# EAGLE design iNDUCTIVE LOOP (EAGLE 7.6.0)
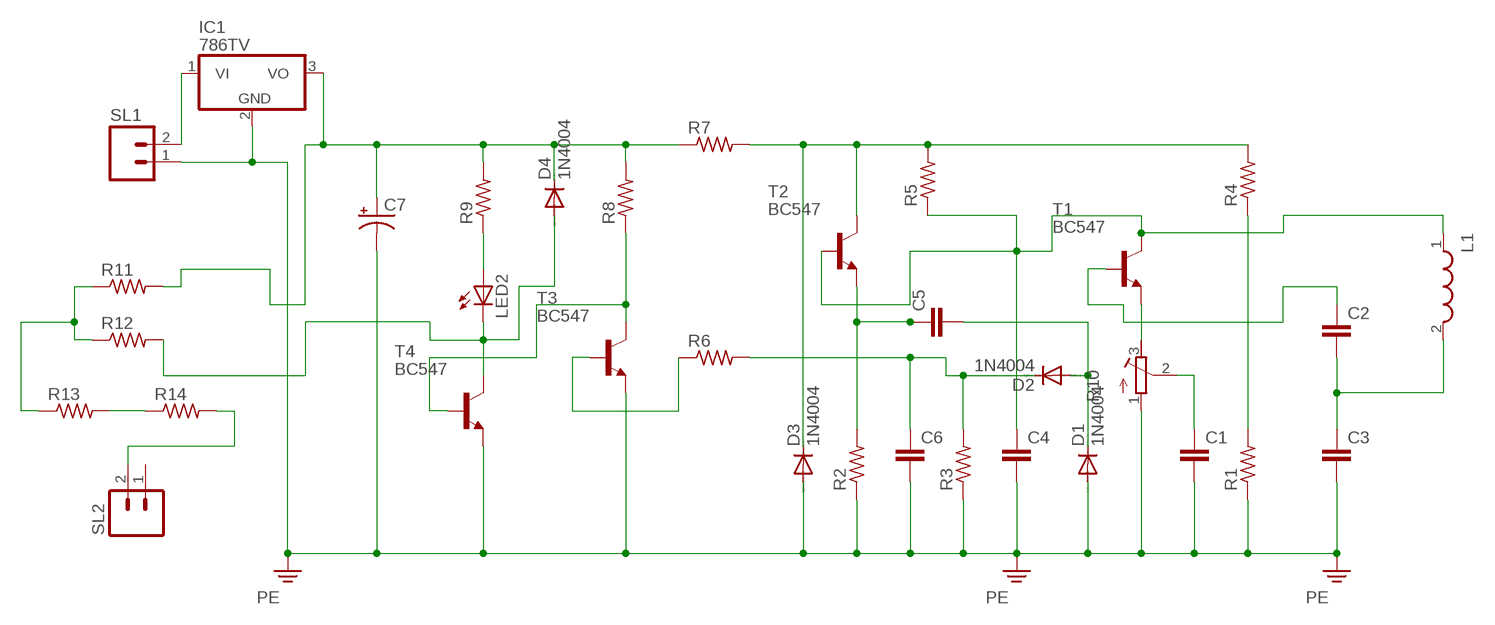
[diagram p0: schematic, sheet 1]

## Parts
C1  C5/2.5  [C5B2.5]
C2  C5/2.5  [C5B2.5]
C3  C5/2.5  [C5B2.5]
C4  C5/2.5  [C5B2.5]
C5  C5/2.5  [C5B2.5]
C6  C5/2.5  [C5B2.5]
C7  CPOL-USE2.5-6  [E2,5-6]
D1  1N4004  [DO41-10]
D2  1N4004  [DO41-10]
D3  1N4004  [DO41-10]
D4  1N4004  [DO41-10]
IC1  786TV  [TO220V]
L1  WE-WPCC_1W_3737  [WE-WPCC_3737]
LED2  LEDLD260  [LD260]
R1  R-US_0204/7  [0204/7]
R2  R-US_0204/7  [0204/7]
R3  R-US_0204/7  [0204/7]
R4  R-US_0204/7  [0204/7]
R5  R-US_0204/7  [0204/7]
R6  R-US_0204/7  [0204/7]
R7  R-US_0204/7  [0204/7]
R8  R-US_0204/7  [0204/7]
R9  R-US_0204/7  [0204/7]
R10  R-TRIMM64P  [RTRIM64P]
R11  R-US_0204/7  [0204/7]
R12  R-US_0204/7  [0204/7]
R13  R-US_0204/7  [0204/7]
R14  R-US_0204/7  [0204/7]
SL1  MA02  [02PA]
SL2  MA02  [02PA]
T1  BC547  [TO92]
T2  BC547  [TO92]
T3  BC547  [TO92]
T4  BC547  [TO92]

## Nets
N$1: R11.1 R12.1 R13.1
N$2: D3.C R4.2 R5.2 R7.2 T2.3(C)
N$3: R6.1 T3.2(B)
N$4: C6.1 D2.C R3.2 R6.2
N$5: R8.1 T3.3(C) T4.2(B)
N$6: LED2.A R9.1
N$7: IC1.1(VI) SL1.2
N$8: D4.A LED2.K(C) R12.2 T4.3(C)
N$10: C5.1 R2.2 T2.1(E)
N$11: C4.1 L1.1 R5.1 T1.3(C) T2.2(B)
N$12: C5.2 D1.C D2.A
N$14: R10.3(E) T1.1(E)
N$15: C1.1 R10.2(S)
N$16: R1.2 R4.1
N$17: C2.2 C3.1 L1.2
N$18: C2.1 T1.2(B)
N$19: C7.+ D4.C IC1.3(VO) R7.1 R8.2 R9.2 R11.2
N$20: R13.2 R14.1
N$21: R14.2 SL2.2
PE: C1.2 C3.2 C4.2 C6.2 C7.- D1.A D3.A IC1.2(GND) R1.1 R2.1 R3.1 R10.1(A) SL1.1 T3.1(E) T4.1(E)
Unconnected: SL2.1

## Library data of the parts
C1-C6 = capacitor-wima:C: CAPACITOR naming: grid - package width
C7 = rcl:CPOL-US: POLARIZED CAPACITOR, American symbol
D1-D4 = diode:1N4004: DIODE general purpose rectifier, 1 A
IC1 = linear:78*: Positive VOLTAGE REGULATOR Source: http://cache.national.com/ds/LM/LM78L05.pdf http://www.fairchildsemi.com/ds/LM/LM7805.pdf
L1 = Wurth_Elektronik_Passive_rev15c:WE-WPCC_1W: Wireless Power Charging Coil -Qi standard compliant -Thinnest on the market -Easiness of assembly -Evaluated and approved by very major semiconductor manufacturer -Litz wire-highest Q-value on the market -Applicable for up to 5W -High permeability shielding -Cancels charging flux to be not coupled into sensitive components or batteries -High reliable construction -- Portable devices used in a clean area .where connectors pose a risk of polluting e.g. medical facilities,(industrial )clean rooms,mining industry --Devices with a large number of mating cycles to avoid connector damage:eg.Smart watches,fittness tracker... --Consumer products:eg. Digital cameras,baby phone,walkie talky remote control,smartphone sleeves,watertight products --Explosion sensitive area where the use of a physical connection is hazardous --Smart sensors <http://katalog.we-online.de/media/images/eisos/UtWPCC_Receiver_pf2.jpg> Details see: http://katalog.we-online.de/en/pbs/WE-WPCC_Receiver Created by Dan Xu 2014-05-21 2014 (C) Würth Elektronik
LED2 = led:LED: LED OSRAM: - CHIPLED LG R971, LG N971, LY N971, LG Q971, LY Q971, LO R971, LY R971 LH N974, LH R974 LS Q976, LO Q976, LY Q976 LO Q996 - Hyper CHIPLED LW Q18S LB Q993, LB Q99A, LB R99A - SideLED LS A670, LO A670, LY A670, LG A670, LP A670 LB A673, LV A673, LT A673, LW A673 LH A674 LY A675 LS A676, LA A676, LO A676, LY A676, LW A676 LS A679, LY A679, LG A679 - Hyper Micro SIDELED® LS Y876, LA Y876, LO Y876, LY Y876 LT Y87S - SmartLED LW L88C, LW L88S LB L89C, LB L89S, LG L890 LS L89K, LO L89K, LY L89K LS L896, LA L896, LO L896, LY L896 - TOPLED LS T670, LO T670, LY T670, LG T670, LP T670 LSG T670, LSP T670, LSY T670, LOP T670, LYG T670 LG T671, LOG T671, LSG T671 LB T673, LV T673, LT T673, LW T673 LH T674 LS T676, LA T676, LO T676, LY T676, LB T676, LH T676, LSB T676, LW T676 LB T67C, LV T67C, LT T67C, LS T67K, LO T67K, LY T67K, LW E67C LS E67B, LA E67B, LO E67B, LY E67B, LB E67C, LV E67C, LT E67C LW T67C LS T679, LY T679, LG T679 LS T770, LO T770, LY T770, LG T770, LP T770 LB T773, LV T773, LT T773, LW T773 LH T774 LS E675, LA E675, LY E675, LS T675 LS T776, LA T776, LO T776, LY T776, LB T776 LHGB T686 LT T68C, LB T68C - Hyper Mini TOPLED® LB M676 - Mini TOPLED Santana® LG M470 LS M47K, LO M47K, LY M47K Source: http://www.osram.convergy.de LUXEON: - LUMILED® LXK2-PW12-R00, LXK2-PW12-S00, LXK2-PW14-U00, LXK2-PW14-V00 LXK2-PM12-R00, LXK2-PM12-S00, LXK2-PM14-U00 LXK2-PE12-Q00, LXK2-PE12-R00, LXK2-PE12-S00, LXK2-PE14-T00, LXK2-PE14-U00 LXK2-PB12-K00, LXK2-PB12-L00, LXK2-PB12-M00, LXK2-PB14-N00, LXK2-PB14-P00, LXK2-PB14-Q00 LXK2-PR12-L00, LXK2-PR12-M00, LXK2-PR14-Q00, LXK2-PR14-R00 LXK2-PD12-Q00, LXK2-PD12-R00, LXK2-PD12-S00 LXK2-PH12-R00, LXK2-PH12-S00 LXK2-PL12-P00, LXK2-PL12-Q00, LXK2-PL12-R00 Source: www.luxeon.com KINGBRIGHT: KA-3528ASYC Source: www.kingbright.com
R1-R9 R11-R14 = rcl:R-US_: RESISTOR, American symbol
R10 = rcl:R-TRIMM: Trimm resistor
SL1 SL2 = con-amp-quick:MA02: AMP QUICK CONNECTOR; OC_FARNELL: unknown; OC_NEWARK: unknown
T1-T4 = transistor:BC547: NPN TRANSISTOR

## Board
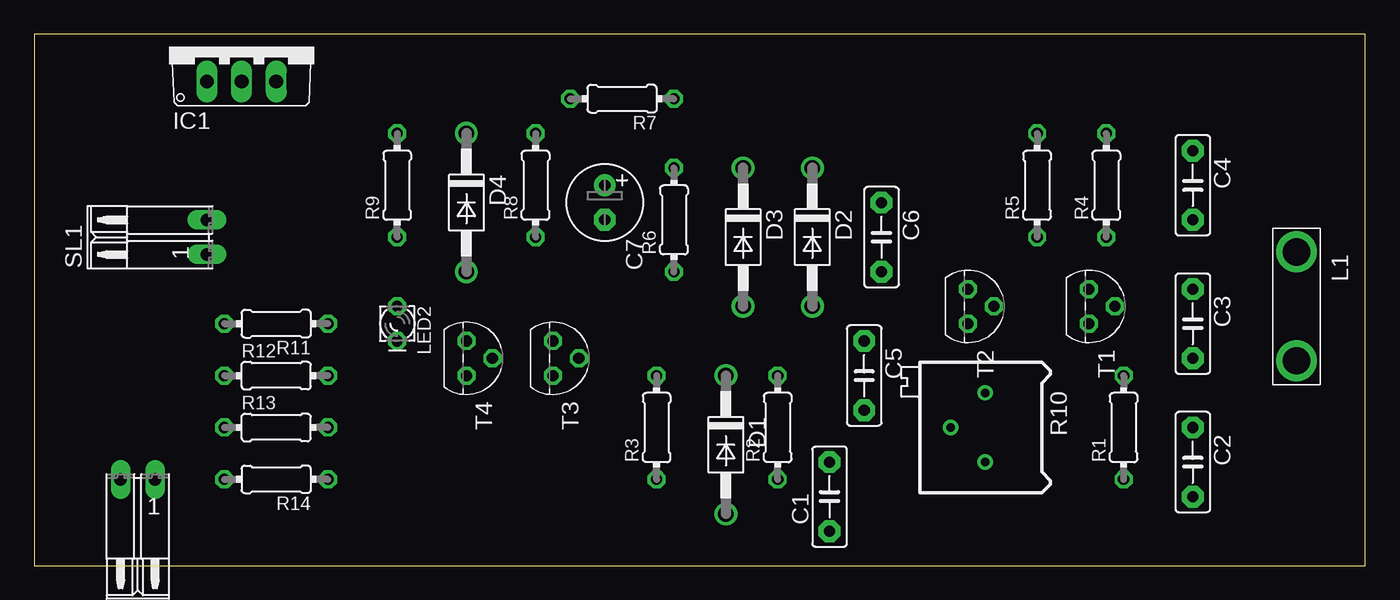
[diagram p1: board, top side]
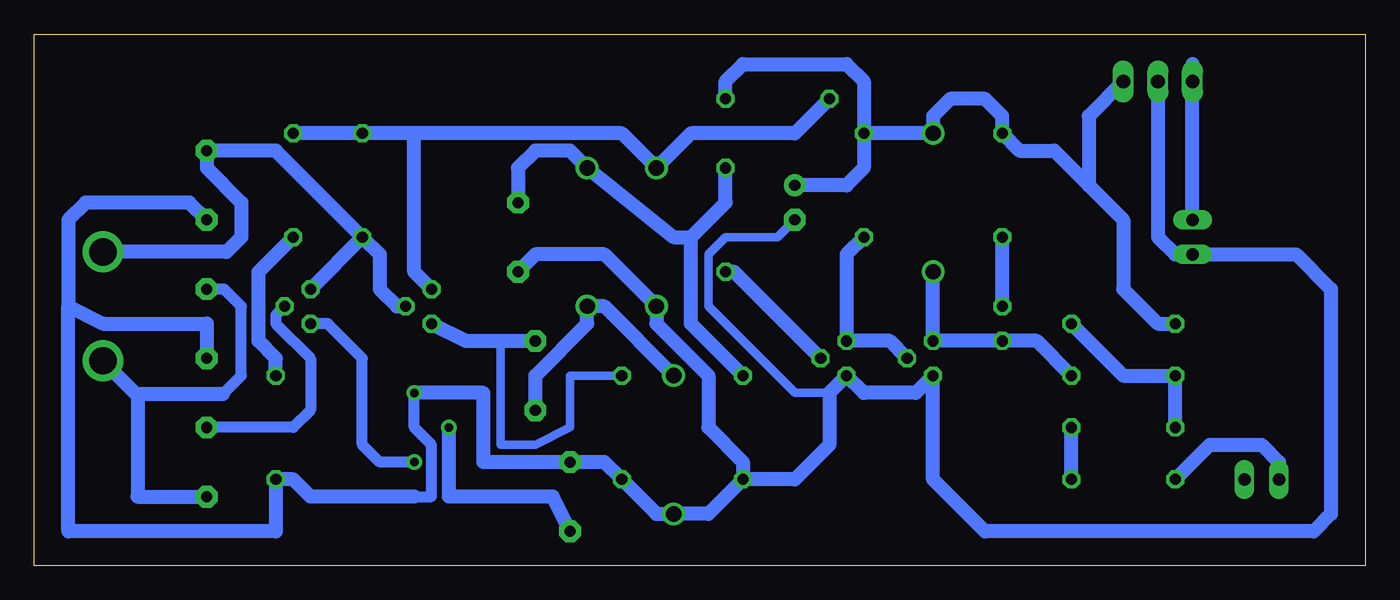
[diagram p2: board, bottom side, seen from below]

Size 97.77 x 39.04 mm. Coordinates in mm from the lower left corner, seen from the top.
Outline: 0,0 97.77,0 97.77,39.04 0,39.04 0,0
Copper layers (1*16): Top 0.035mm / dielectric 1.5mm / Bottom 0.035mm
Design rules "default": minimum track width 10mil, minimum drill 24mil, track to track 8mil, track to pad 8mil, pad to pad 8mil, via to via 8mil, smd to smd 8mil, copper to edge 40mil, drill to drill 8mil, minimum pad ring 10mil, minimum via ring 8mil, stop-mask expansion 4mil, vias tented up to drill 0mil, thermal gap 10mil

### Footprints (pad centres in the part's own frame; a part is rotated, then mirrored left to right if it is on the bottom)
C5B2.5 = drill 0.813 pad 1.6 octagon: 1 -2.54,0; 2 2.54,0
E2,5-6 = drill 0.813 pad 1.6: + -1.27,0 | drill 0.813 pad 1.6 octagon: - 1.27,0
DO41-10 = drill 1.118: A 5.08,0; C -5.08,0
TO220V = drill 1.016 long: 1 -2.54,-2.54; 2 0,-2.54; 3 2.54,-2.54
WE-WPCC_3737 = drill 2: 1 -4,0; 2 4,0
LD260 = drill 0.813 octagon: A -1.27,0; K 1.27,0
0204/7 = drill 0.813 octagon: 1 -3.81,0; 2 3.81,0
RTRIM64P = drill 0.61: 1 0,-2.54; 2 2.54,0; 3 0,2.54
02PA = drill 0.914 long: 1 -1.27,0; 2 1.27,0
TO92 = drill 0.813 octagon: 1 1.27,0; 2 0,1.905; 3 -1.27,0

### Placement (x,y rotation side)
C1  58.42,5.08 90 top
C2  85.09,7.62 270 top
C3  85.09,17.78 270 top
C4  85.09,27.94 270 top
C5  60.96,13.97 270 top
C6  62.23,24.13 270 top
C7  41.91,26.67 270 top
D1  50.8,8.89 270 top
D2  57.15,24.13 270 top
D3  52.07,24.13 270 top
D4  31.75,26.67 270 top
IC1  15.24,38.1 0 top
L1  92.71,19.05 270 top
LED2  26.67,17.78 270 top
R1  80.01,10.16 90 top
R2  54.61,10.16 90 top
R3  45.72,10.16 90 top
R4  78.74,27.94 90 top
R5  73.66,27.94 90 top
R6  46.99,25.4 90 top
R7  43.18,34.29 180 top
R8  36.83,27.94 90 top
R9  26.67,27.94 90 top
R10  69.85,10.16 180 top
R11  17.78,17.78 180 top
R12  17.78,13.97 0 top
R13  17.78,10.16 0 top
R14  17.78,6.35 180 top
SL1  12.7,24.13 90 top
SL2  7.62,6.35 180 top
T1  77.47,19.05 270 top
T2  68.58,19.05 270 top
T3  38.1,15.24 270 top
T4  31.75,15.24 270 top

### Tracks (layer width: path | path; a pad name or v marks a point on that pad's centre or on a via)
N$1
  Bottom 1.016: R11.1 17.78,13.97 R12.1 R13.1
N$2
  Bottom 1.016: R7.2 41.91,31.75 49.53,31.75 D3.C 54.61,31.75 69.85,31.75 | 69.85,31.75 R5.2 R4.2 | T2.3 69.85,21.59 69.85,31.75
N$3
  Bottom 1.016: T3.2 46.36,21.59 R6.1
N$4
  Bottom 1.016: C6.1 62.23,29.21 60.96,30.48 58.42,30.48 D2.C 50.8,24.13 49.53,24.13 | R3.2 49.53,17.78 49.53,24.13 | 49.53,24.13 46.99,26.67 R6.2
N$5
  Bottom 1.016: T4.2 34.92,16.51 T3.3 38.1,22.86 R8.1
N$6
  Bottom 1.016: LED2.A R9.1
N$7
  Bottom 1.016: SL1.2 IC1.1 12.7,36.83
N$8
  Bottom 1.016: D4.A T4.3 LED2.K 24.13,16.51 R12.2
N$10
  Bottom 0.61: R2.2 58.42,13.97 58.42,10.16 60.96,8.89 63.5,8.89 63.5,16.51
  Bottom 1.016: T2.1 66.04,16.51 63.5,16.51 C5.1
N$11
  Bottom 1.016: R5.1 80.01,30.48 C4.1 85.09,29.21 82.55,26.67 82.55,24.13 83.63,23.05 L1.1 | R5.1 72.39,22.86 72.39,20.32 71.12,19.05 T2.2 | R5.1 T1.3
N$12
  Bottom 1.016: C5.2 60.96,13.97 57.15,17.78 D2.A 55.88,19.05 D1.C
N$14
  Bottom 0.813: R10.3 72.39,7.62 73.66,8.89 73.66,15.24 76.2,17.78 T1.1
N$15
  Bottom 1.016: R10.2 67.31,5.08 59.69,5.08 C1.1
N$16
  Bottom 1.016: R1.2 80.01,15.24 81.28,16.51 81.28,21.59 R4.1
N$17
  Bottom 0.813: 83.92,12.6 82.55,13.97 82.55,19.05 83.82,20.32 C3.1
  Bottom 1.016: L1.2 90.27,12.6 | 90.27,12.6 90.17,12.51 90.17,5.08 C2.2 | 83.92,12.6 90.27,12.6
N$18
  Bottom 0.813: T1.2 80.01,18.41 80.01,17.78 77.47,15.24 77.47,11.43 78.74,10.16 C2.1
N$19
  Bottom 1.016: R8.2 D4.C 31.75,33.02 30.48,34.29 27.94,34.29 26.67,33.02 R9.2 25.4,30.48 22.86,30.48 20.32,27.94 | R8.2 36.83,29.21 38.1,27.94 C7.+ | R7.1 46.99,35.56 45.72,36.83 38.1,36.83 36.83,35.56 R8.2 | IC1.3 20.32,33.02 20.32,27.94 | 20.32,27.94 17.78,25.4 17.78,20.32 15.24,17.78 R11.2
N$20
  Bottom 1.016: R14.1 R13.2
N$21
  Bottom 1.016: R14.2 11.43,8.89 7.62,8.89 6.35,7.62 SL2.2
PE
  Bottom 0.61: C7.- 43.18,24.13 46.99,24.13 48.26,22.86 48.26,19.05 41.91,12.7 39.37,12.7
  Bottom 0.813: 69.85,5.08 68.58,5.08 68.58,8.89 69.85,10.16 R10.1
  Bottom 1.016: R3.1 41.91,6.35 39.37,8.89 39.37,12.7 T3.1 36.83,12.7 33.02,12.7 T4.1 31.75,6.35 27.94,2.54 3.81,2.54 2.54,3.81 2.54,20.32 5.08,22.86 SL1.1 13.97,22.86 15.24,24.13 IC1.2 | R3.1 48.26,3.81 D1.A 52.07,3.81 R2.1 55.88,7.62 C1.2 64.77,7.62 64.77,12.7 R10.1 | C6.2 60.96,22.86 55.88,22.86 D3.A 52.07,17.78 48.26,13.97 48.26,10.16 45.72,7.62 R3.1 | 69.85,5.08 77.47,5.08 78.74,6.35 R1.1 80.01,2.54 95.25,2.54 95.25,19.05 | C4.2 86.36,26.67 93.98,26.67 95.25,25.4 95.25,19.05 | 95.25,19.05 92.71,17.78 85.09,17.78 C3.2